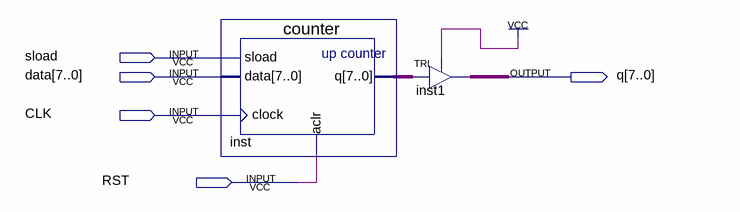
[diagram p0: schematic sheet]
// Quartus schematic CNT8B.bdf as structural Verilog: 2 symbols, 5 pins
module CNT8B (
  input  sload,
  input  [7:0] data,
  input  CLK,
  input  RST,
  output [7:0] q
);

  wire [7:0] inst_q;

  counter inst (.sload(sload), .data(data), .clock(CLK), .aclr(RST), .q(inst_q));
  TRI inst1[7:0] (.IN(inst_q), .OE(1'b1), .OUT(q));
endmodule
